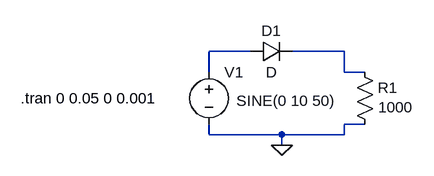
[diagram p0: schematic Lab0.asc]
Lab0.asc, the LTspice schematic file:
Version 4
SHEET 1 880 680
WIRE 160 112 96 112
WIRE 304 112 224 112
WIRE 96 144 96 112
WIRE 304 144 304 112
WIRE 336 144 304 144
WIRE 336 224 304 224
WIRE 96 240 96 224
WIRE 208 240 96 240
WIRE 304 240 304 224
WIRE 304 240 208 240
WIRE 208 256 208 240
FLAG 208 256 0
SYMBOL voltage 96 128 R0
WINDOW 3 42 60 Left 2
WINDOW 123 0 0 Left 0
WINDOW 39 0 0 Left 0
SYMATTR InstName V1
SYMATTR Value SINE(0 10 50)
SYMBOL diode 160 128 R270
WINDOW 0 32 32 VTop 2
WINDOW 3 0 32 VBottom 2
SYMATTR InstName D1
SYMBOL res 320 128 R0
WINDOW 3 37 70 Left 2
SYMATTR InstName R1
SYMATTR Value 1000
TEXT -194 184 Left 2 !.tran 0 0.05 0 0.001

The netlist it stands for:
* Lab0.asc
V1 N001 0 SINE(0 10 50)
D1 N001 N002 D
R1 N002 0 1000
.model D D
.lib standard.dio
.tran 0 0.05 0 0.001
.backanno
.end